# Altium project doamPCB.PrjPCB
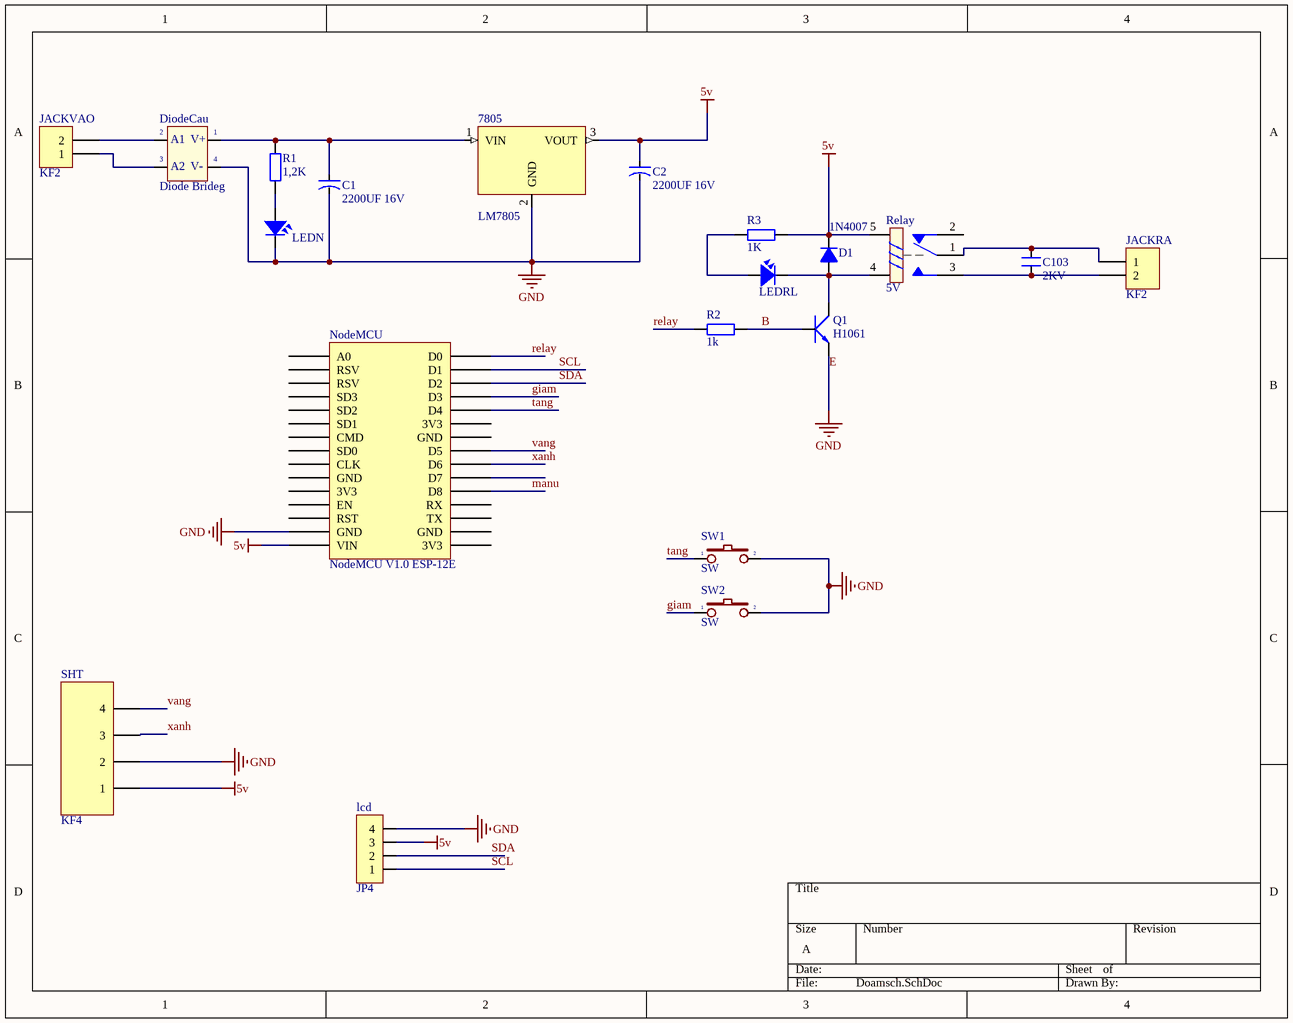
[diagram p0: Doamsch.SchDoc]
1 sheet, 20 parts. Net scope: global (net labels, ports and power ports of the same name join across sheets).
Board file: doamEsp.PcbDoc

## Sheet Doamsch.SchDoc
size A

### Parts
7805  LM7805  [QTO-220H3]
C1  2200UF 16V  [CA-ALU-10]
C2  2200UF 16V  [CA-ALU-10]
C103  2KV  [CN2.5]
D1  1N4007  [D1A]
DiodeCau  Diode Brideg  [DIO-Bri 5A]
JACKRA  KF2  [KF2-5.08]
JACKVAO  KF2  [KF2-5.08]
lcd  JP4  [JP4-C1T]
LEDN  LED  [LED-5-RED]  (value not drawn)
LEDRL  LED  [LED-5-RED]  (value not drawn)
NodeMCU  NodeMCU V1.0 ESP-12E  [NodeMCU V1.0 ESP-12E]
Q1  H1061  [QTO-220]
R1  1,2K  [R1/4W]
R2  1k  [R1/4W]
R3  1K  [R1/4W]
Relay  5V  [RELAY 5]
SHT  KF4  [KF4-5.08]
SW1  SW  [SW-2P-S]
SW2  SW  [SW-2P-S]

### Nets
5v: 7805.3(VOUT) C2.1 D1.2(K) lcd.3 NodeMCU.VIN R3.2 Relay.5 SHT.1
E: 7805.2(GND) C1.2 C2.2 DiodeCau.4(-V_OUT) lcd.4 LEDN.2 NodeMCU.GND Q1.3(E) SHT.2 SW1.2 SW2.2  [also labelled GND]
B: Q1.1(B) R2.2
giam: NodeMCU.D3 SW2.1
manu: NodeMCU.D8
relay: NodeMCU.D0 R2.1
SCL: lcd.1 NodeMCU.D1
SDA: lcd.2 NodeMCU.D2
tang: NodeMCU.D4 SW1.1
vang: NodeMCU.D5 SHT.4
xanh: NodeMCU.D6 SHT.3
Net7805_1: 7805.1(VIN) C1.1 DiodeCau.1(+V_OUT) R1.2
NetC103_1: C103.1 JACKRA.2 Relay.3
NetC103_2: C103.2 JACKRA.1 Relay.1
NetD1_1: D1.1(A) LEDRL.2 Q1.2(C) Relay.4
NetDiodeCau_2: DiodeCau.2(AC1) JACKVAO.2
NetDiodeCau_3: DiodeCau.3(AC2) JACKVAO.1
NetLEDN_1: LEDN.1 R1.1
NetLEDRL_1: LEDRL.1 R3.1

Not connected (* = marked no-connect by the designer): NodeMCU 3V3 A0 CLK CMD D7 EN RST RSV RX SD0 SD1 SD2 SD3 TX; Relay 2

### Notes on the sheet
- (in symbol DIODE BRIGDE) A1; V+; A2; V-

### Library data of the parts
7805 = LM7805: TO-220; Text Field1: 70; Text Field2: 30
C1 C2 = CN-ALU-DIP: Capacitor (Semiconductor SIM Model); Value: 104; LatestRevisionDate: 17-Jul-2002; LatestRevisionNote: Re-released for DXP Platform.; PackageReference: C1206; Publisher: Altium Limited
C103 = CN: Value: 33pF
D1 = D1A: Diode 1A; Value: 1N4007
DiodeCau = DIODE BRIGDE: Convert AC to DC voltage, 4 pin; Value: Cau 1A
JACKRA JACKVAO = KF2: Manufacturer: Würth Elektronik eiSos GmbH; partNo: 691103110002; ComponentLink1 Description: Manufacturer; ComponentLink2 Description: Datasheet; NoPins: 2; Created Date: 29 October 2013; ComponentLink1URL: http://www.we-online.com; ComponentLink2URL: http://katalog.we-online.de/em/datasheet/6911031100xx.pdf; Created by: Karrer Zheng
lcd = JP4: WR-PHD 2.54 mm Angled Socket Header; Manufacturer: W¨¹rth Elektronik eiSos GmbH; partNo: 613004143121; ComponentLink1 Description: Manufacturer; ComponentLink2 Description: Datasheet; NoPins: 04; Created Date: 29 March 2013; ComponentLink1URL: http://www.we-online.com; ComponentLink2URL: http://katalog.we-online.de/em/datasheet/6130xx143121.pdf; Created by: Karrer Zheng
LEDN LEDRL = LED: LED Single colour Green and Red; Value: LED 3 ly Single Colour
NodeMCU = NodeMCU V1.0 ESP-12E: NodeMCU V1.0 ESP8266 (ESP-12E)
Q1 = NPN_BCE: P 1W, BCE; Value: TIP41
R1-R3 = R1/4W: Resistor 1/4W; Value: R1/4W - 1K
Relay = Relay 5: Relay SPDT,10A - 12VDC 5 Pin; Value: Relay SPDT, 10A, 12V
SHT = KF4: Manufacturer: W¨¹rth Elektronik eiSos GmbH; PartNo: 691133710004; ComponentLink1 Description: Manufacturer; ComponentLink2 Description: Datasheet; NoPins: 4; ComponentLink1 URL: http://www.we-online.com; ComponentLink2 URL: http://katalog.we-online.de/em/datasheet/6911337100xx.pdf; Created By: Baojun Chen; Created Date: 4-Aug-15
SW1 SW2 = SW2: Switch button 2 pin; Value: SW chip 2 pin